# Altium schematic sheet Sheet_1_2026-02-17 (1).schdoc
size 287 x 200 mm; SheetNumber: 2; SheetTotal: 4
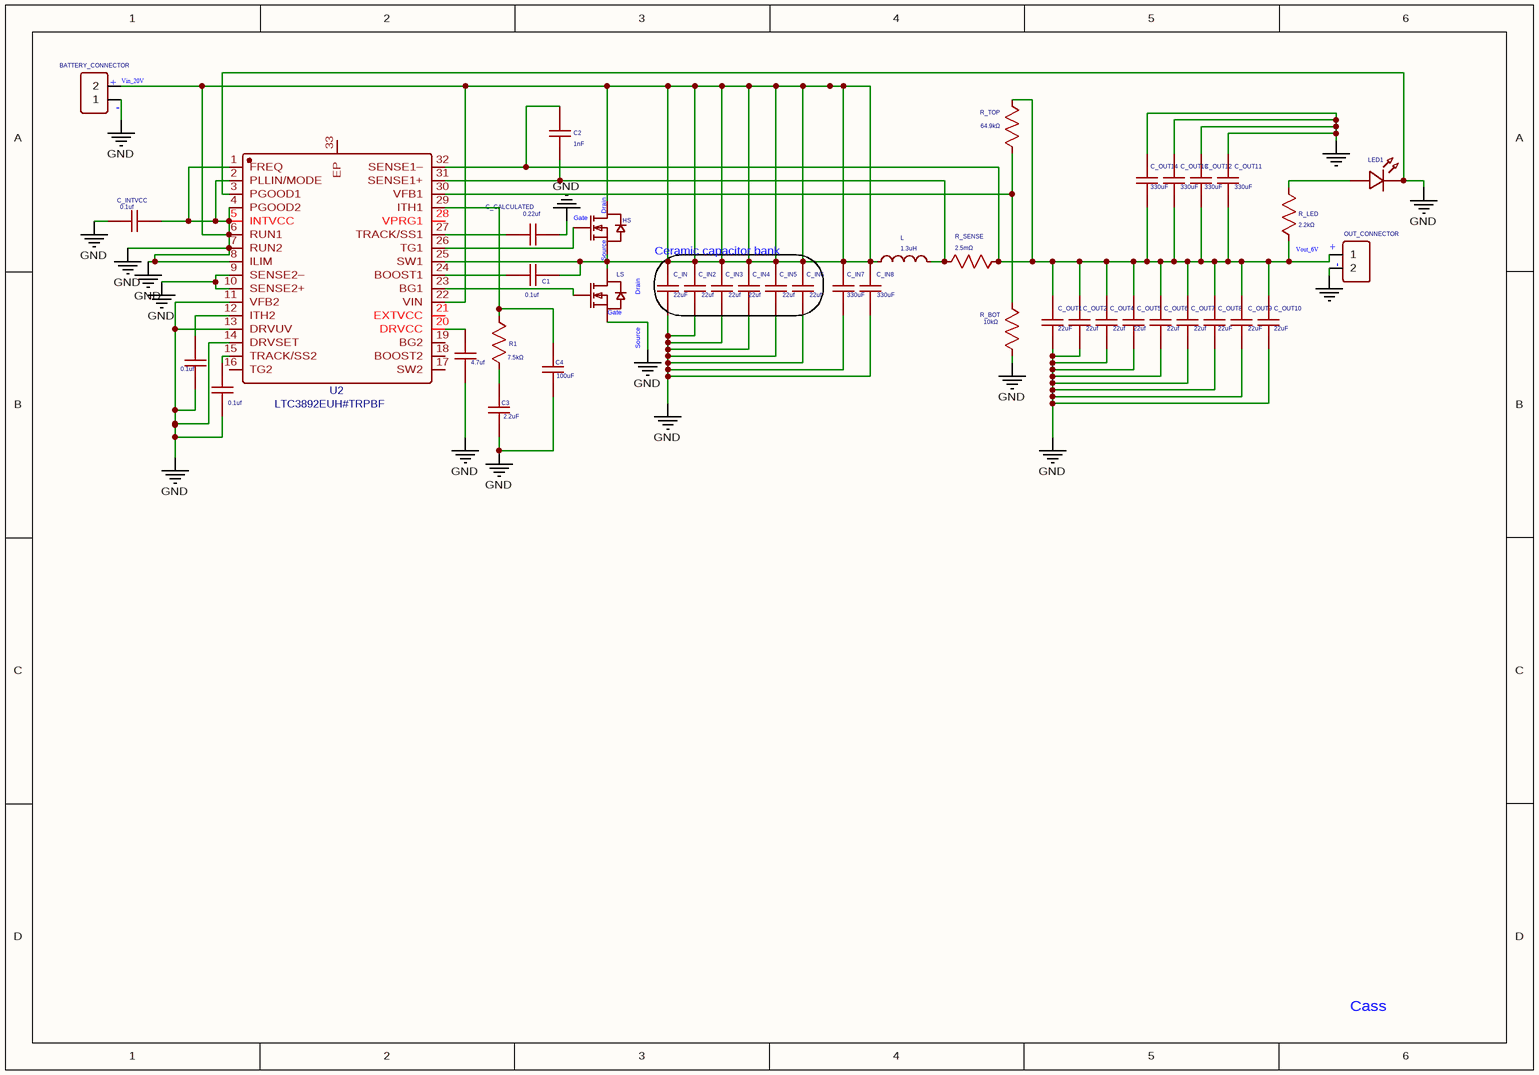
[diagram p0: Sheet_1_2026-02-17 (1).schdoc]

## Parts
BATTERY_CONNECTOR  CONN-TH_2P-P5.00  [CONN-TH_2P-P5.00]  (value not drawn)
C1  0.1uf  [C0603]
C2  1nF  [C0603]
C3  2.2uF  [C0603]
C4  100uF  [C0603]
C_CALCULATED  0.22uf  [C0603]
C_DRVCC  4.7uf  [C0603]
C_IN  22uF  [C0603]
C_IN2  22uf  [C0603]
C_IN3  22uf  [C0603]
C_IN4  22uf  [C0603]
C_IN5  22uf  [C0603]
C_IN6  22uf  [C0603]
C_IN7  330uF  [C0603]
C_IN8  330uF  [C0603]
C_INTVCC  0.1uf  [C0603]
C_INTVCC1  0.1uf  [C0603]
C_INTVCC2  0.1uf  [C0603]
C_OUT1  22uF  [C0603]
C_OUT2  22uf  [C0603]
C_OUT4  22uf  [C0603]
C_OUT5  22uf  [C0603]
C_OUT6  22uf  [C0603]
C_OUT7  22uf  [C0603]
C_OUT8  22uF  [C0603]
C_OUT9  22uF  [C0603]
C_OUT10  22uF  [C0603]
C_OUT11  330uF  [C0603]
C_OUT12  330uF  [C0603]
C_OUT13  330uF  [C0603]
C_OUT14  330uF  [C0603]
HS  2N7002  [SOT-23_L2.9-W1.3-P0.95-LS2.4-BR]  (value not drawn)
L  1.3uH  [L0603]
LED1  LED-0603_B  [LED0603_BLUE]  (value not drawn)
LS  2N7002  [SOT-23_L2.9-W1.3-P0.95-LS2.4-BR]  (value not drawn)
OUT_CONNECTOR  CONN-TH_2P-P5.00  [CONN-TH_2P-P5.00]  (value not drawn)
R1  7.5kΩ  [R0603]
R_BOT  10kΩ  [R0603]
R_LED  2.2kΩ  [R0603]
R_SENSE  2.5mΩ  [R0603]
R_TOP  64.9kΩ  [R0603]
U2  LTC3892EUH#TRPBF  [QFN-32_L5.0-W5.0-P0.50-TL-EP3.5]

## Blocks framed on the sheet
Ceramic capacitor bank: C_IN C_IN2-C_IN6

## Nets
+: BATTERY_CONNECTOR.1 BATTERY_CONNECTOR.2 C1.1 C2.2 C3.1 C4.2 C_CALCULATED.2 C_DRVCC.1 C_IN.1 C_IN.2 C_IN2.1 C_IN2.2 C_IN3.1 C_IN3.2 C_IN4.1 C_IN4.2 C_IN5.1 C_IN5.2 C_IN6.1 C_IN6.2 C_IN7.1 C_IN7.2 C_IN8.1 C_IN8.2 C_INTVCC.1 C_INTVCC.2 C_INTVCC1.2 C_INTVCC2.1 C_OUT1.1 C_OUT1.2 C_OUT2.1 C_OUT2.2 C_OUT4.1 C_OUT4.2 C_OUT5.1 C_OUT5.2 C_OUT6.1 C_OUT6.2 C_OUT7.1 C_OUT7.2 C_OUT8.1 C_OUT8.2 C_OUT9.1 C_OUT9.2 C_OUT10.1 C_OUT10.2 C_OUT11.1 C_OUT11.2 C_OUT12.1 C_OUT12.2 C_OUT13.1 C_OUT13.2 C_OUT14.1 C_OUT14.2 HS.2(S) HS.3(D) L.1 LED1.2 LS.2(S) LS.3(D) OUT_CONNECTOR.1 OUT_CONNECTOR.2 R_BOT.2 R_LED.1 R_SENSE.1 R_TOP.1 U2.1(FREQ) U2.2(PLLIN/MODE) U2.3(PGOOD1) U2.4(PGOOD2) U2.5(INTVCC) U2.6(RUN1) U2.7(RUN2) U2.8(ILIM) U2.9(SENSE2–) U2.10(SENSE2+) U2.11(VFB2) U2.13(DRVUV) U2.14(DRVSET) U2.22(VIN) U2.25(SW1) U2.32(SENSE1–)  [also labelled -, GND, Vin_20V]
NetC1_2: C1.2 U2.24(BOOST1)
NetC2_1: C2.1 L.2 R_SENSE.2 U2.31(SENSE1+)
NetC3_2: C3.2 R1.1
NetC4_1: C4.1 R1.2 U2.29(ITH1)
NetC_CALCULATED_1: C_CALCULATED.1 U2.27(TRACK/SS1)
NetC_DRVCC_2: C_DRVCC.2 U2.20(DRVCC)
NetC_INTVCC1_1: C_INTVCC1.1 U2.15(TRACK/SS2)
NetC_INTVCC2_2: C_INTVCC2.2 U2.12(ITH2)
NetHS_1: HS.1(G) U2.26(TG1)
NetLED1_1: LED1.1 R_LED.2
NetLS_1: LS.1(G) U2.23(BG1)
NetR_BOT_1: R_BOT.1 R_TOP.2 U2.30(VFB1)

Not connected (* = marked no-connect by the designer): U2 16(TG2) 17(SW2) 18(BOOST2) 19(BG2) 21(EXTVCC) 28(VPRG1) 33(EP)

## Notes on the sheet
- (near HS) Gate
- (near HS) Drain
- (near HS) Source
- (near LS) Gate
- Source
- Drain
- Cass
- Labels drawn without touching a wire or pin: Vout_6V

## Library data of the parts
BATTERY_CONNECTOR OUT_CONNECTOR = CONN-TH_2P-P5.00: Contributor: LCEDA_Lib; Supplier: LCSC; spicePre: P; spiceSymbolName: CONN-TH_2P-P5.00
C1 = 0.1uf: nameAlias: Value(F); Contributor: LCEDA_Lib; spicePre: C; spiceSymbolName: C_0603_US
C2 = 1nF: nameAlias: Value(F); Contributor: LCEDA_Lib; spicePre: C; spiceSymbolName: C_0603_US
C3 = 2.2uF: nameAlias: Value(F); Contributor: LCEDA_Lib; spicePre: C; spiceSymbolName: C_0603_US
C4 = 100uF: nameAlias: Value(F); Contributor: LCEDA_Lib; spicePre: C; spiceSymbolName: C_0603_US
C_CALCULATED = 0.22uf: nameAlias: Value(F); Contributor: LCEDA_Lib; spicePre: C; spiceSymbolName: C_0603_US
C_DRVCC = 4.7uf: nameAlias: Value(F); Contributor: LCEDA_Lib; Package Display: No; spicePre: C; spiceSymbolName: C_0603_US
C_IN C_OUT1 C_OUT8-C_OUT10 = 22uF: nameAlias: Value(F); Contributor: LCEDA_Lib; spicePre: C; spiceSymbolName: C_0603_US
C_IN2-C_IN6 C_OUT2 C_OUT4-C_OUT7 = 22uf: nameAlias: Value(F); Contributor: LCEDA_Lib; spicePre: C; spiceSymbolName: C_0603_US
C_IN7 C_IN8 C_OUT11-C_OUT14 = 330uF: nameAlias: Value(F); Contributor: LCEDA_Lib; spicePre: C; spiceSymbolName: C_0603_US
C_INTVCC C_INTVCC1 C_INTVCC2 = 0.1uf: nameAlias: Value(F); Contributor: LCEDA_Lib; Package Display: No; spicePre: C; spiceSymbolName: C_0603_US
HS LS = 2N7002: Manufacturer: Nexperia; Manufacturer Part: 2N7002,215; Paste Type: expand; Contributor: LCEDA_Lib; Package Display: No; Supplier: LCSC; image: //image.lceda.cn/szlcsc/C65189.jpg; Supplier Part: C65189; spicePre: Q; spiceSymbolName: 2N7002
L = 1.3uH: nameAlias: Value(H); Contributor: LCEDA_Lib; spicePre: L; spiceSymbolName: L0603_US
LED1 = LED-0603_B: Manufacturer: EVERLIGHT(台湾亿光); Manufacturer Part: 19-217/BHC-ZL1M2RY/3T; Contributor: LCEDA_01; Supplier Part: C72041; Supplier: LCSC; spicePre: L; spiceSymbolName: LED-0603_B
R1 = 7.5kΩ: nameAlias: Value(Ω); Contributor: LCEDA_Lib; spicePre: R; spiceSymbolName: R_0603_US
R_BOT = 10kΩ: nameAlias: Value(Ω); Contributor: LCEDA_Lib; Package Display: No; spicePre: R; spiceSymbolName: R_0603_US
R_LED = 2.2kΩ: nameAlias: Value(Ω); Contributor: LCEDA_Lib; Package Display: No; spicePre: R; spiceSymbolName: R_0603_US
R_SENSE = 2.5mΩ: nameAlias: Value(Ω); Contributor: LCEDA_Lib; spicePre: R; spiceSymbolName: R_0603_US
R_TOP = 64.9kΩ: nameAlias: Value(Ω); Contributor: LCEDA_Lib; spicePre: R; spiceSymbolName: R_0603_US
U2 = LTC3892EUH#TRPBF: Manufacturer: ADI(亚德诺); Contributor: LCSC; Supplier: LCSC; Supplier Part: C687012; Manufacturer Part: LTC3892EUH#TRPBF; JLCPCB Part Class: Extended Part; spicePre: U; spiceSymbolName: LTC3892EUH#TRPBF